# Altium project OpenRing-V1R1.PrjPcb (part 2 of 2)

## Sheet OpenRing_Memory.SchDoc
size A4; Size: A4; ApprovedBy: Dariush Salami; DrawnBy: Yusein Ali; Engineer: Yusein Ali; Revision: A0; SheetNumber: 3; SheetTotal: 9
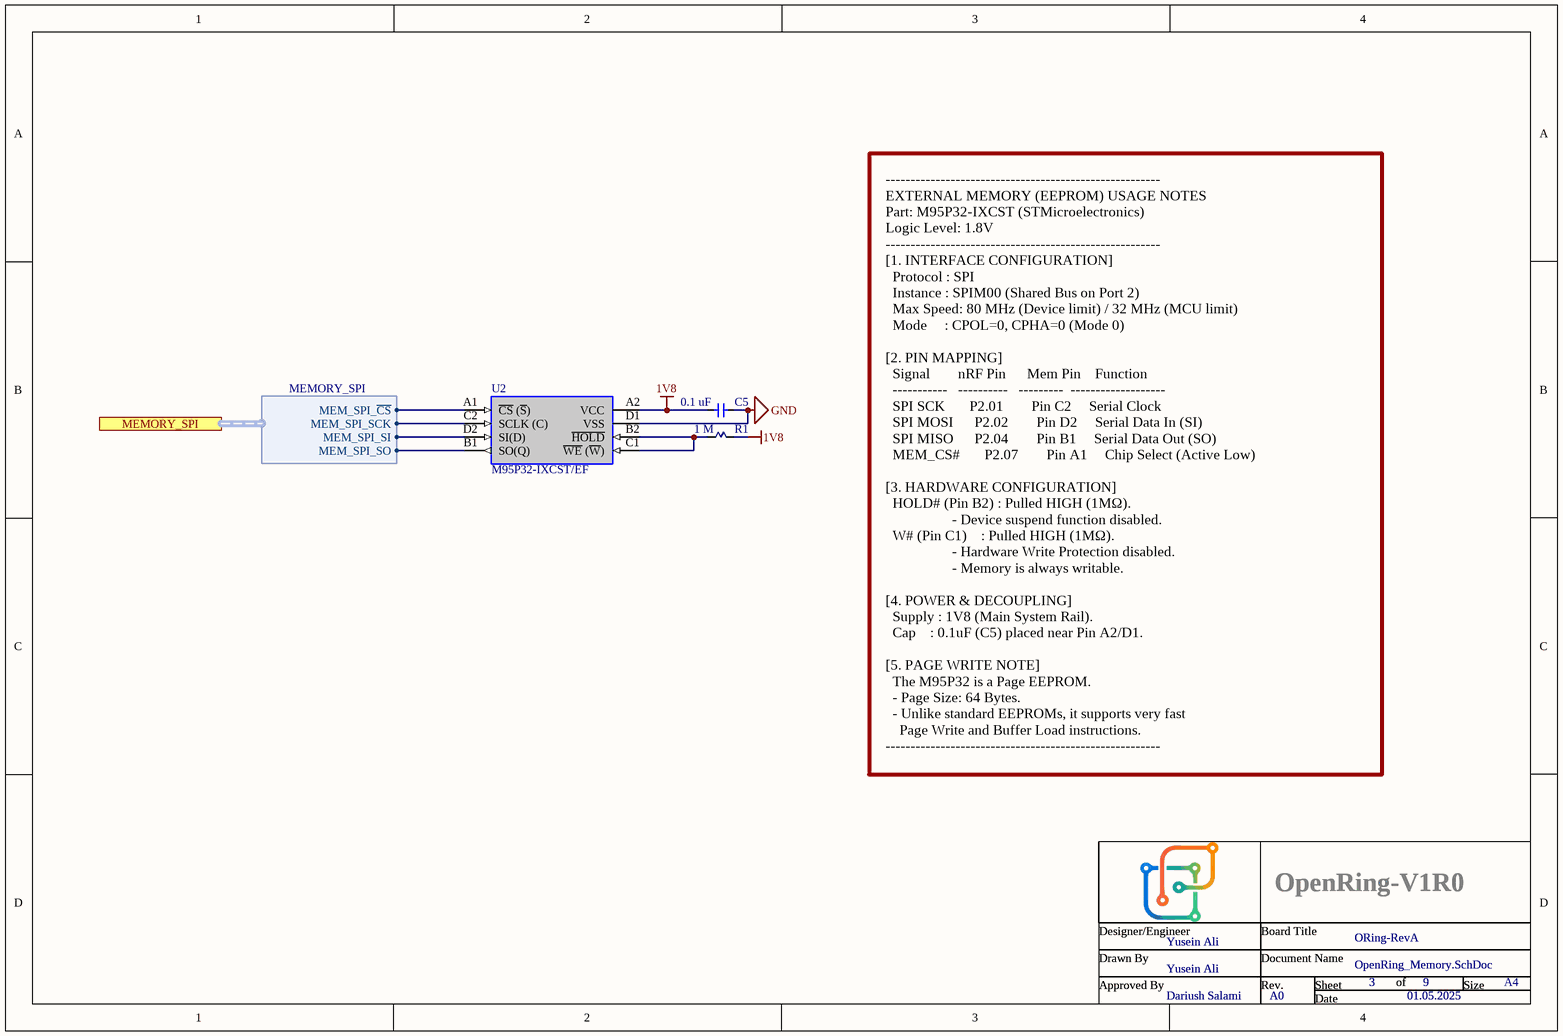
[diagram p4: OpenRing_Memory.SchDoc]

### Parts
C5  0.1 uF  [CAPC1005X05N]
R1  1 M  [RESC1005X04N]
U2  M95P32-IXCST/EF  [BGA8C70P2X4_153X261X58]

### Ports
MEMORY_SPI (harness MEMORY_SPI)

### Harnesses
MEMORY_SPI: MEM_SPI_~{CS}, MEM_SPI_SI, MEM_SPI_SO, MEM_SPI_SCK

### Nets
1V8: C5.2 R1.2 U2.A2(VCC)
GND: C5.1 U2.D1(VSS)
MEM_SPI_~{CS}: U2.A1(~{CS}_(~{S})) ; port MEMORY_SPI.MEM_SPI_~{CS}
MPU_CLK: U2.C2(SCLK_(C)) ; port MEMORY_SPI.MEM_SPI_SCK
MPU_MISO: U2.B1(SO(Q)) ; port MEMORY_SPI.MEM_SPI_SO
MPU_MOSI: U2.D2(SI(D)) ; port MEMORY_SPI.MEM_SPI_SI
NetR1_1: R1.1 U2.B2(~{HOLD}) U2.C1(~{WE}_(~{W}))

### Notes on the sheet
- -------------------------------------------------------
  EXTERNAL MEMORY (EEPROM) USAGE NOTES
  Part: M95P32-IXCST (STMicroelectronics)
  Logic Level: 1.8V
  -------------------------------------------------------
  [1. INTERFACE CONFIGURATION]
  Protocol : SPI
  Instance : SPIM00 (Shared Bus on Port 2)
  Max Speed: 80 MHz (Device limit) / 32 MHz (MCU limit)
  Mode     : CPOL=0, CPHA=0 (Mode 0)
  [2. PIN MAPPING]
  Signal        nRF Pin      Mem Pin    Function
  -----------   ----------   ---------  -------------------
  SPI SCK       P2.01        Pin C2     Serial Clock
  SPI MOSI      P2.02        Pin D2     Serial Data In (SI)
  SPI MISO      P2.04        Pin B1     Serial Data Out (SO)
  MEM_CS#       P2.07        Pin A1     Chip Select (Active Low)
  [3. HARDWARE CONFIGURATION]
  HOLD# (Pin B2) : Pulled HIGH (1MΩ).
  - Device suspend function disabled.
  W# (Pin C1)    : Pulled HIGH (1MΩ).
  - Hardware Write Protection disabled.
  - Memory is always writable.
  [4. POWER & DECOUPLING]
  Supply : 1V8 (Main System Rail).
  Cap    : 0.1uF (C5) placed near Pin A2/D1.
  [5. PAGE WRITE NOTE]
  The M95P32 is a Page EEPROM.
  - Page Size: 64 Bytes.
  - Unlike standard EEPROMs, it supports very fast
  Page Write and Buffer Load instructions.
  -------------------------------------------------------
- Designer/Engineer
- Drawn By
- Document Name
- Board Title
- Sheet
- of
- Size
- A4
- Approved By
- Rev.
- Date

### Library data of the parts
C5 = GRM155R61C104KA88D: CAP CER 0.1UF 16V X5R 0402; Manufacturer: Murata Electronics; Tolerance: 10 %; Type: Chip Multilayer Ceramic Capacitor for General Purpose; Voltage Rating DC: 16 VDC; Capacitance - nF: 100 nF; Capacitance - pF: 100000 pF; Supplier 1: Mouser; Manufacturer Part Number: GRM155R61C104KA88D; RoHS: RoHS Compliant; Category: Multilayer Ceramic Capacitors MLCC - SMD/SMT; Packaging: Cut Tape; Capacitance: 0.1 uF; Package / Case: 0402 (1005 metric); ComponentLink1URL: http://www.mouser.com/datasheet/2/281/murata_03052018_GRM_Series_1-1310166.pdf; ComponentLink1Description: http://www.mouser.com/datasheet/2/281/murata_03052018_GRM_Series_1-1310166.pdf; Supplier Part Number 1: 81-GRM155R61C104KA8D; Value: 0.1 uF; Stock: 0; Pricing: 1=0.082, 10=0.026, 100=0.011, 500=0.008, 1000=0.007, 2500=0.006, 5000=0.005, 10000=0.004 (EUR); Height: 0.5 mm; Length: 1 mm; Product: General Type MLCCs; Series: GRM; Termination Style: SMD/SMT; Width: 0.5 mm; Brand: Murata Electronics; Case Code - in: 0402; Case Code - mm: 1005; Dielectric: X5R; Maximum Operating Temperature: + 85 C; Minimum Operating Temperature: - 55 C; Standard Pack Qty: 10000; Termination: Standard; RoHS - Mouser: Y; Minimum Order Quantity: 1; Reeling: True; Supplier 2: Digikey; Supplier Part Number 2: 490-5415-1-ND; Supplier 3: Digikey; Supplier Part Number 3: 490-5415-6-ND
R1 = ERJ-2RKF1004X: RES SMD 1M OHM 1% 1/10W 0402; Manufacturer: Panasonic Electronic Components; Power (Watts): 0.1W, 1/10W; Temperature Coefficient: ±100ppm/°C; Supplier 1: Digi-Key; Manufacturer Part Number: ERJ-2RKF1004X; RoHS: RoHS Compliant; Category: Resistors; Stock 1: 1590446; Pricing 1: 1=0.1, 10=0.025, 25=0.018, 50=0.0136, 100=0.01, 250=0.00764, 500=0.00612, 1000=0.00451, 5000=0.00323 (USD); Packaging: Digi-Reel®; Part Status: Active; Resistance (Ohms): 1M; Tolerance: ±1%; Composition: Thick Film; Features: Automotive AEC-Q200; Operating Temperature: -55°C ~ 155°C; Package / Case: 0402 (1005 Metric); Supplier Device Package: 0402; Size / Dimension: 0.039" L x 0.020" W (1.00mm x 0.50mm); Height - Seated (Max): 0.016" (0.40mm); Number of Terminations: 2; Failure Rate: -; ComponentLink1URL: https://industrial.panasonic.com/cdbs/www-data/pdf/RDA0000/AOA0000C283.pdf; ComponentLink1Description: https://industrial.panasonic.com/cdbs/www-data/pdf/RDA0000/AOA0000C283.pdf; Supplier Part Number 1: P1.00MLDKR-ND; Value: 1 M
U2 = M95P32-IXCST/EF: M95P32-I Series 32 Mb (4 M x 8) 80 MHz SPI EEPROM Memory IC - WLCSP-8; Manufacturer: STMicroelectronics; Supplier: Digikey; Supplier Part Number: 497-M95P32-IXCST/EFDKR-ND; Manufacturer Part Number: M95P32-IXCST/EF; RoHS: No; Category: Memory; Stock: 9222; Pricing: 1=2.68, 10=2.409, 25=2.2724, 100=1.9362, 250=1.818, 500=1.59076, 1000=1.31805, 2500=1.22715 (USD); Supplier 1: Mouser; Supplier Part Number 1: 511-M95P32-IXCST/EF; Supplier 2: Digikey; Supplier Part Number 2: 497-M95P32-IXCST/EFCT-ND

## Sheet OpenRing_RGB.SchDoc
size A4; Size: A4; ApprovedBy: Dariush Salami; DrawnBy: Yusein Ali; Engineer: Yusein Ali; Revision: A0; SheetNumber: 6; SheetTotal: 9
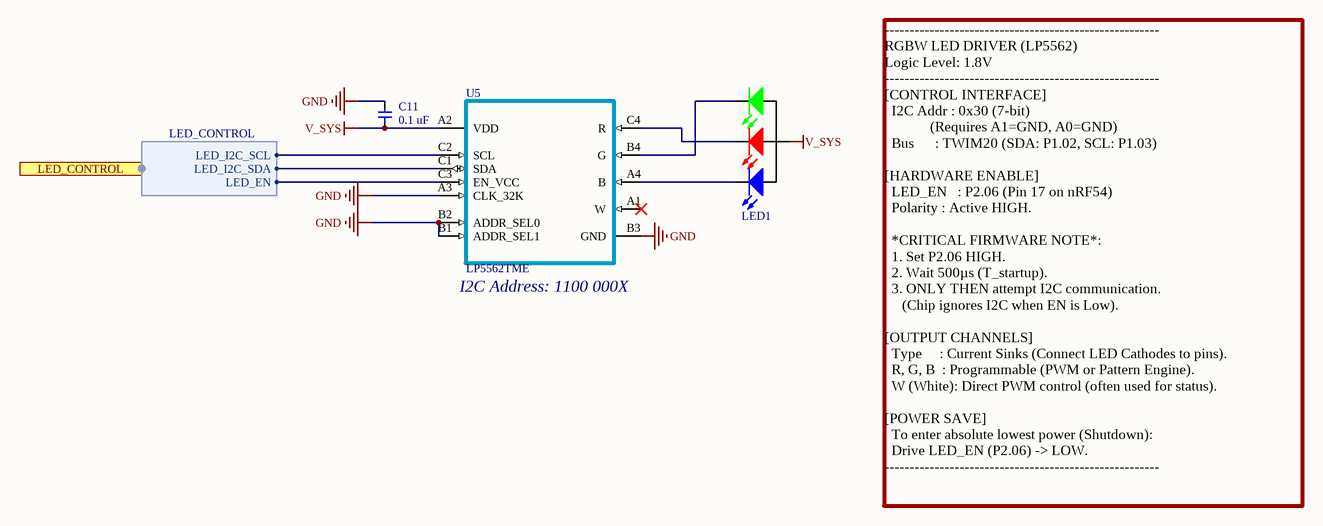
[diagram p5: OpenRing_RGB.SchDoc]

### Parts
C11  0.1 uF  [CAPC1005X05N]
LED1  SML-LX0404SIUPGUSB  [SML-LX0404SIUPGUSB]  (value not drawn)
U5  LP5562TME  [BGA12C40P4X3_162X122X68]

### Ports
LED_CONTROL (harness LED_CONTROL)

### Harnesses
LED_CONTROL: LED_I2C_SCL, LED_I2C_SDA, LED_EN

### Nets
GND: C11.2 U5.A3(CLK_32K) U5.B1(ADDR_SEL1) U5.B2(ADDR_SEL0) U5.B3(GND)
V_SYS: C11.1 LED1.1(A) U5.A2(VDD)
LED_EN: U5.C3(EN_VCC) ; port LED_CONTROL.LED_EN
PWR_I2C_SCL: U5.C2(SCL) ; port LED_CONTROL.LED_I2C_SCL
PWR_I2C_SDA: U5.C1(SDA) ; port LED_CONTROL.LED_I2C_SDA
NetLED1_2: LED1.2(K) U5.C4(R)
NetLED1_3: LED1.3(K) U5.A4(B)
NetLED1_4: LED1.4(K) U5.B4(G)

Not connected (* = marked no-connect by the designer): U5 A1(W)*

### Notes on the sheet
- (near U5) I2C Address: 1100 000X
- -------------------------------------------------------
  RGBW LED DRIVER (LP5562)
  Logic Level: 1.8V
  -------------------------------------------------------
  [CONTROL INTERFACE]
  I2C Addr : 0x30 (7-bit)
  (Requires A1=GND, A0=GND)
  Bus      : TWIM20 (SDA: P1.02, SCL: P1.03)
  [HARDWARE ENABLE]
  LED_EN   : P2.06 (Pin 17 on nRF54)
  Polarity : Active HIGH.
  *CRITICAL FIRMWARE NOTE*:
  1. Set P2.06 HIGH.
  2. Wait 500µs (T_startup).
  3. ONLY THEN attempt I2C communication.
  (Chip ignores I2C when EN is Low).
  [OUTPUT CHANNELS]
  Type     : Current Sinks (Connect LED Cathodes to pins).
  R, G, B  : Programmable (PWM or Pattern Engine).
  W (White): Direct PWM control (often used for status).
  [POWER SAVE]
  To enter absolute lowest power (Shutdown):
  Drive LED_EN (P2.06) -> LOW.
  -------------------------------------------------------
- Designer/Engineer
- Drawn By
- Document Name
- Board Title
- Sheet
- of
- Size
- A4
- Approved By
- Rev.
- Date

### Library data of the parts
C11 = GRM155R61C104KA88D: as C5 on sheet OpenRing_Memory; Supplier 1: Mouser; Manufacturer Part Number: GRM155R61C104KA88D; RoHS: RoHS Compliant; Category: Multilayer Ceramic Capacitors MLCC - SMD/SMT; Packaging: Cut Tape; Capacitance: 0.1 uF; Package / Case: 0402 (1005 metric); ComponentLink1URL: http://www.mouser.com/datasheet/2/281/murata_03052018_GRM_Series_1-1310166.pdf; ComponentLink1Description: http://www.mouser.com/datasheet/2/281/murata_03052018_GRM_Series_1-1310166.pdf; Supplier Part Number 1: 81-GRM155R61C104KA8D; Value: 0.1 uF; Stock: 0; Pricing: 1=0.082, 10=0.026, 100=0.011, 500=0.008, 1000=0.007, 2500=0.006, 5000=0.005, 10000=0.004 (EUR); Height: 0.5 mm; Length: 1 mm; Product: General Type MLCCs; Series: GRM; Termination Style: SMD/SMT; Width: 0.5 mm; Brand: Murata Electronics; Case Code - in: 0402; Case Code - mm: 1005; Dielectric: X5R; Maximum Operating Temperature: + 85 C; Minimum Operating Temperature: - 55 C; Standard Pack Qty: 10000; Termination: Standard; RoHS - Mouser: Y; Minimum Order Quantity: 1; Reeling: True; Supplier 2: Digikey; Supplier Part Number 2: 490-5415-1-ND; Supplier 3: Digikey; Supplier Part Number 3: 490-5415-6-ND
LED1 = SML-LX0404SIUPGUSB: LED Low-Power Tri-Color Blue/Green/Red 465nm/518nm/632nm 2.7V/2.75V/1.95V 4-Pin SMD T/R; Manufacturer: Lumex; Color: Blue,Green,Red; Lens Color: Colorless; Lens Transparency: Clear; Viewing Angle: 120°; Lens Style: Square,Clear,Rectangular; Forward Current: 2mA; Luminous Intensity: 20mcd; Forward Voltage: 2.73V; Number of LEDs: 3; Wavelength: 465nm; Power Rating: 30mW; Reverse Voltage: 5V; Manufacturer Part Number: SML-LX0404SIUPGUSB; RoHS: Yes; Category: LEDs; Packaging: Tape and Reel; ComponentLink1URL: https://datasheet.ciiva.com/1246/1423960-1246392.pdf?src-supplier=Element14; ComponentLink1Description: https://datasheet.ciiva.com/1246/1423960-1246392.pdf?src-supplier=Element14; Supplier: Mouser; Supplier Part Number: 696-LX0404SIUPGUSB; Stock: 113976; Pricing: 1=0.94, 10=0.633, 50=0.633, 100=0.518, 1000=0.444, 10000=0.371 (USD); Mounting Technology: Surface Mount; Case/Package: 0404; Case Code (Metric): 1010; Case Code (Imperial): 0404; Min Operating Temperature: -40°C; Max Operating Temperature: 85°C; Package Quantity: 2000; Test Current: 2mA; Series: -; Moisture Sensitivity Level: 4; Length: 1mm; Width: 1mm; Height: 0.3mm; Reach SVHC Compliant: No; Lead Free: Lead Free; RoHS Compliant: Yes; ComponentLink2URL: https://datasheet.ciiva.com/1333/lumex-quasarbrite-0404smdrgb-productbrochure-1333009.pdf?src-supplier=Newark; ComponentLink2Description: https://datasheet.ciiva.com/1333/lumex-quasarbrite-0404smdrgb-productbrochure-1333009.pdf?src-supplier=Newark; ComponentLink3URL: https://datasheet.ciiva.com/2118/sml-lx0404siupgusb-2118652.pdf?src-supplier=Digikey; ComponentLink3Description: https://datasheet.ciiva.com/2118/sml-lx0404siupgusb-2118652.pdf?src-supplier=Digikey; ComponentLink4URL: https://datasheet.ciiva.com/4689/sml-lx0404siupgusb-202559-4689572.pdf?src-supplier=Mouser; ComponentLink4Description: https://datasheet.ciiva.com/4689/sml-lx0404siupgusb-202559-4689572.pdf?src-supplier=Mouser; ComponentLink5URL: https://datasheet.ciiva.com/16199/sml-lx0404siupgusb-16199820.pdf?src-supplier=Future+Electronics; ComponentLink5Description: https://datasheet.ciiva.com/16199/sml-lx0404siupgusb-16199820.pdf?src-supplier=Future+Electronics; ComponentLink6URL: https://datasheet.ciiva.com/1246/1484526-1246779.pdf?src-supplier=Element14; ComponentLink6Description: https://datasheet.ciiva.com/1246/1484526-1246779.pdf?src-supplier=Element14; ComponentLink7URL: https://datasheet.ciiva.com/2118/sml-lx0404siupgusb-2118653.pdf?src-supplier=Digikey; ComponentLink7Description: https://datasheet.ciiva.com/2118/sml-lx0404siupgusb-2118653.pdf?src-supplier=Digikey; ComponentLink8URL: https://datasheet.ciiva.com/2118/sml-lx0404siupgusb-2118654.pdf?src-supplier=Digikey; ComponentLink8Description: https://datasheet.ciiva.com/2118/sml-lx0404siupgusb-2118654.pdf?src-supplier=Digikey; ComponentLink9URL: https://datasheet.ciiva.com/14604/70127422-14604949.pdf?src-supplier=Allied+Electronics; ComponentLink9Description: https://datasheet.ciiva.com/14604/70127422-14604949.pdf?src-supplier=Allied+Electronics
U5 = LP5562TME/NOPB: IC LED DRIVER LINEAR DIM 25.5MA; Manufacturer: Texas Instruments; Internal Switch(s): Yes; Number of Outputs: 4; Voltage - Supply (Min): 2.7V; Voltage - Supply (Max): 5.5V; Frequency: 256kHz, 558kHz; Dimming: I²C; Supplier 1: Digi-Key; Manufacturer Part Number: LP5562TME/NOPB; RoHS: RoHS Compliant; Category: Integrated Circuits (ICs); Stock 1: 4154; Pricing 1: 1=1.34, 10=1.195, 100=0.9314 (USD); Packaging: Digi-Reel®; Part Status: Active; Type: Linear; Topology: -; Voltage - Output: -; Current - Output / Channel: 25.5mA; Applications: Backlight; Operating Temperature: -40°C ~ 85°C (TA); Mounting Type: Surface Mount; Package / Case: 12-WFBGA, DSBGA; Supplier Device Package: 12-DSBGA; ComponentLink1URL: http://www.ti.com/lit/ds/symlink/lp5562.pdf; ComponentLink1Description: http://www.ti.com/lit/ds/symlink/lp5562.pdf; Supplier Part Number 1: 296-39060-6-ND

## Sheet OpenRing_DaughterBoard.SchDoc
size A4; SheetNumber: 9; SheetTotal: 9
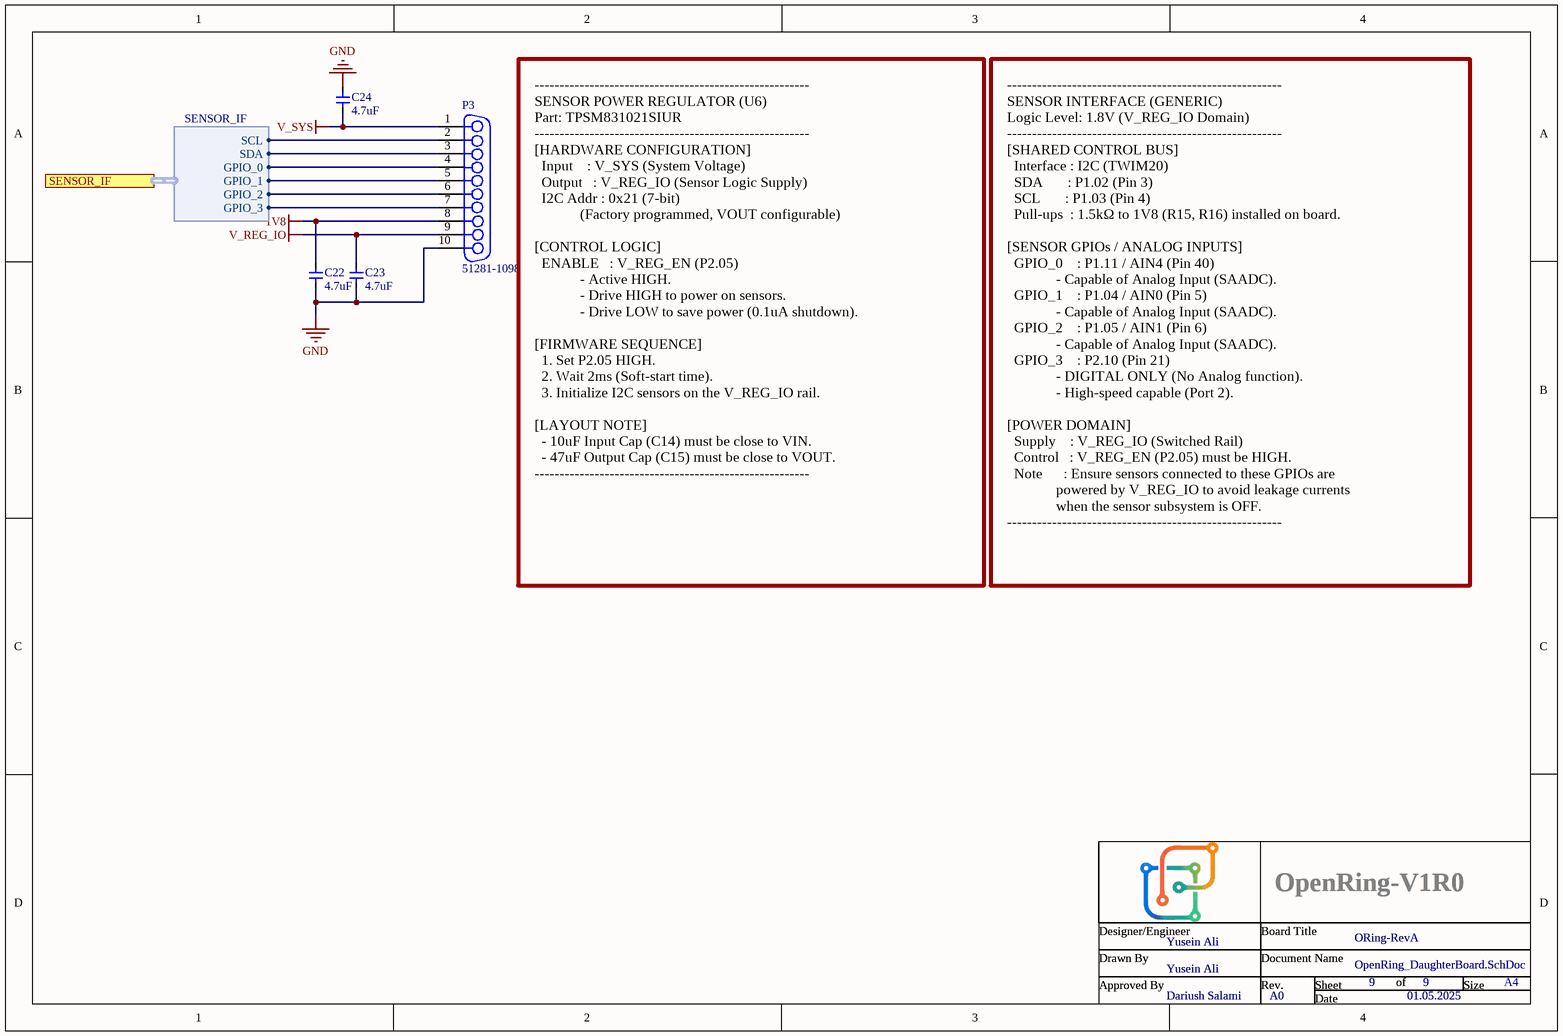
[diagram p6: OpenRing_DaughterBoard.SchDoc]

### Parts
C22  4.7uF  [CAPC1005X05N]
C23  4.7uF  [CAPC1005X05N]
C24  4.7uF  [CAPC1005X05N]
P3  51281-1098  [51281-1098]

### Ports
SENSOR_IF (harness SENSOR_IF)

### Harnesses
SENSOR_IF: SCL, SDA, GPIO_0, GPIO_1, GPIO_2, GPIO_3

### Nets
1V8: C22.2 P3.8
GND: C22.1 C23.1 C24.2 P3.10
V_REG_IO: C23.2 P3.9
V_SYS: C24.1 P3.1
PWR_I2C_SCL: P3.2 ; port SENSOR_IF.SCL
PWR_I2C_SDA: P3.3 ; port SENSOR_IF.SDA
SENSOR_GPIO_0: P3.4 ; port SENSOR_IF.GPIO_0
SENSOR_GPIO_1: P3.5 ; port SENSOR_IF.GPIO_1
SENSOR_GPIO_2: P3.6 ; port SENSOR_IF.GPIO_2
SENSOR_GPIO_3: P3.7 ; port SENSOR_IF.GPIO_3

### Notes on the sheet
- -------------------------------------------------------
  SENSOR POWER REGULATOR (U6)
  Part: TPSM831021SIUR
  -------------------------------------------------------
  [HARDWARE CONFIGURATION]
  Input    : V_SYS (System Voltage)
  Output   : V_REG_IO (Sensor Logic Supply)
  I2C Addr : 0x21 (7-bit)
  (Factory programmed, VOUT configurable)
  [CONTROL LOGIC]
  ENABLE   : V_REG_EN (P2.05)
  - Active HIGH.
  - Drive HIGH to power on sensors.
  - Drive LOW to save power (0.1uA shutdown).
  [FIRMWARE SEQUENCE]
  1. Set P2.05 HIGH.
  2. Wait 2ms (Soft-start time).
  3. Initialize I2C sensors on the V_REG_IO rail.
  [LAYOUT NOTE]
  - 10uF Input Cap (C14) must be close to VIN.
  - 47uF Output Cap (C15) must be close to VOUT.
  -------------------------------------------------------
- -------------------------------------------------------
  SENSOR INTERFACE (GENERIC)
  Logic Level: 1.8V (V_REG_IO Domain)
  -------------------------------------------------------
  [SHARED CONTROL BUS]
  Interface : I2C (TWIM20)
  SDA       : P1.02 (Pin 3)
  SCL       : P1.03 (Pin 4)
  Pull-ups  : 1.5kΩ to 1V8 (R15, R16) installed on board.
  [SENSOR GPIOs / ANALOG INPUTS]
  GPIO_0    : P1.11 / AIN4 (Pin 40)
  - Capable of Analog Input (SAADC).
  GPIO_1    : P1.04 / AIN0 (Pin 5)
  - Capable of Analog Input (SAADC).
  GPIO_2    : P1.05 / AIN1 (Pin 6)
  - Capable of Analog Input (SAADC).
  GPIO_3    : P2.10 (Pin 21)
  - DIGITAL ONLY (No Analog function).
  - High-speed capable (Port 2).
  [POWER DOMAIN]
  Supply    : V_REG_IO (Switched Rail)
  Control   : V_REG_EN (P2.05) must be HIGH.
  Note      : Ensure sensors connected to these GPIOs are
  powered by V_REG_IO to avoid leakage currents
  when the sensor subsystem is OFF.
  -------------------------------------------------------
- Designer/Engineer
- Drawn By
- Document Name
- Board Title
- Sheet
- of
- Size
- A4
- Approved By
- Rev.
- Date

### Library data of the parts
C22-C24 = GRM155R61A475MEAAD: Multilayer Ceramic Capacitor, 4.7 uF, 10 V, ± 20%, X5R, 0402 [1005 Metric]; Manufacturer: Murata; Material: 4241ConductorMaterial; Voltage Rating: 10V; Dielectric: 1537DielectricType; Manufacturer Part Number: GRM155R61A475MEAAD; RoHS: Yes; Category: Ceramic Capacitors; Stock: 930000; Pricing: 10000=0,0187, 50000=0,0159, 100000=0,0132 (USD); Mounting Technology: Surface Mount; Case/Package: 0402; Case Code (Imperial): 0402; Case Code (Metric): 1005; Min Operating Temperature: -55°C; Max Operating Temperature: 85°C; Packaging: Tape and Reel; Value: 4.7uF; Tolerance: 20%; Series: GRM; Voltage Rating (DC): 10V; Length: 1mm; Width: 500um; Height: 650um; Thickness: 500um; RoHS Compliant: Yes; ComponentLink1URL: http://www.farnell.com/datasheets/2189109.pdf?src-supplier=Farnell; ComponentLink1Description: http://www.farnell.com/datasheets/2189109.pdf?src-supplier=Farnell; ComponentLink2URL: http://www.farnell.com/datasheets/2189109.pdf?src-supplier=Newark; ComponentLink2Description: http://www.farnell.com/datasheets/2189109.pdf?src-supplier=Newark; ComponentLink3URL: http://www.farnell.com/datasheets/2189109.pdf?src-supplier=Element14; ComponentLink3Description: http://www.farnell.com/datasheets/2189109.pdf?src-supplier=Element14; ComponentLink4URL: http://datasheet.octopart.com/GRM155R61A475MEAAD-Murata-datasheet-68589269.pdf?src-supplier=Distrelec; ComponentLink4Description: http://datasheet.octopart.com/GRM155R61A475MEAAD-Murata-datasheet-68589269.pdf?src-supplier=Distrelec; ComponentLink5URL: http://datasheet.octopart.com/GRM155R61A475MEAAD-Murata-datasheet-68589269.pdf?src-supplier=Farnell; ComponentLink5Description: http://datasheet.octopart.com/GRM155R61A475MEAAD-Murata-datasheet-68589269.pdf?src-supplier=Farnell; ComponentLink6URL: https://search.murata.co.jp/Ceramy/image/img/A01X/G101/ENG/GRM155R61A475MEAA-01.pdf?src-supplier=Digi-Key; ComponentLink6Description: https://search.murata.co.jp/Ceramy/image/img/A01X/G101/ENG/GRM155R61A475MEAA-01.pdf?src-supplier=Digi-Key; ComponentLink7URL: http://datasheet.octopart.com/GRM155R61A475MEAAD-Murata-datasheet-68589269.pdf?src-supplier=Future+Electronics; ComponentLink7Description: http://datasheet.octopart.com/GRM155R61A475MEAAD-Murata-datasheet-68589269.pdf?src-supplier=Future+Electronics; ComponentLink8URL: https://datasheet.octopart.com/GRM155R61A475MEAAD-Murata-datasheet-68589269.pdf?src-supplier=Newark; ComponentLink8Description: https://datasheet.octopart.com/GRM155R61A475MEAAD-Murata-datasheet-68589269.pdf?src-supplier=Newark; ComponentLink9URL: http://datasheet.octopart.com/GRM155R61A475MEAAD-Murata-datasheet-68589269.pdf?src-supplier=Verical; ComponentLink9Description: http://datasheet.octopart.com/GRM155R61A475MEAAD-Murata-datasheet-68589269.pdf?src-supplier=Verical; ComponentLink10URL: https://datasheet.octopart.com/GRM155R61A475MEAAD-Murata-datasheet-165579666.pdf?src-supplier=TME; ComponentLink10Description: https://datasheet.octopart.com/GRM155R61A475MEAAD-Murata-datasheet-165579666.pdf?src-supplier=TME; ComponentLink11URL: http://datasheet.octopart.com/GRM155R61A475MEAAD-Murata-datasheet-68589269.pdf?src-supplier=Quest; ComponentLink11Description: http://datasheet.octopart.com/GRM155R61A475MEAAD-Murata-datasheet-68589269.pdf?src-supplier=Quest; ComponentLink12URL: http://datasheet.octopart.com/GRM155R61A475MEAAD-Murata-datasheet-68589269.pdf?src-supplier=TTI; ComponentLink12Description: http://datasheet.octopart.com/GRM155R61A475MEAAD-Murata-datasheet-68589269.pdf?src-supplier=TTI; ComponentLink13URL: http://datasheet.octopart.com/GRM155R61A475MEAAD-Murata-datasheet-68589269.pdf?src-supplier=NAC+Semi; ComponentLink13Description: http://datasheet.octopart.com/GRM155R61A475MEAAD-Murata-datasheet-68589269.pdf?src-supplier=NAC+Semi; Supplier 1: Mouser; Supplier Part Number 1: 81-GRM155R61A475MEAD; Supplier 2: Farnell; Supplier Part Number 2: 3581674
P3 = 51281-1098: FFC/FPC Connector, Surface Mount, Right-Angle, Non-ZIF, Dual Contact Style; Manufacturer: Molex; Supplier: Digikey; Supplier Part Number: 900-0512811098CT-ND; Manufacturer Part Number: 51281-1098; RoHS: No; Stock: 2876; Pricing: 1=0.7, 10=0.594, 25=0.5568, 50=0.53, 100=0.5047, 250=0.47304, 500=0.45042, 1000=0.42891 (USD); ComponentLink1URL: https://datasheet.octopart.com/51281-1098-Molex-datasheet-165827616.pdf?src-supplier=Farnell; ComponentLink1Description: https://datasheet.octopart.com/51281-1098-Molex-datasheet-165827616.pdf?src-supplier=Farnell; Supplier 1: Mouser; Supplier Part Number 1: 538-51281-1098; Supplier 2: Digikey; Supplier Part Number 2: 900-0512811098CT-ND; Supplier 3: Digikey; Supplier Part Number 3: 900-0512811098DKR-ND; System: Connector

## Sheet OpenRing_Power.SchDoc
size A4; Size: A4; ApprovedBy: Dariush Salami; DrawnBy: Yusein Ali; Engineer: Yusein Ali; Revision: A0; SheetNumber: 4; SheetTotal: 9
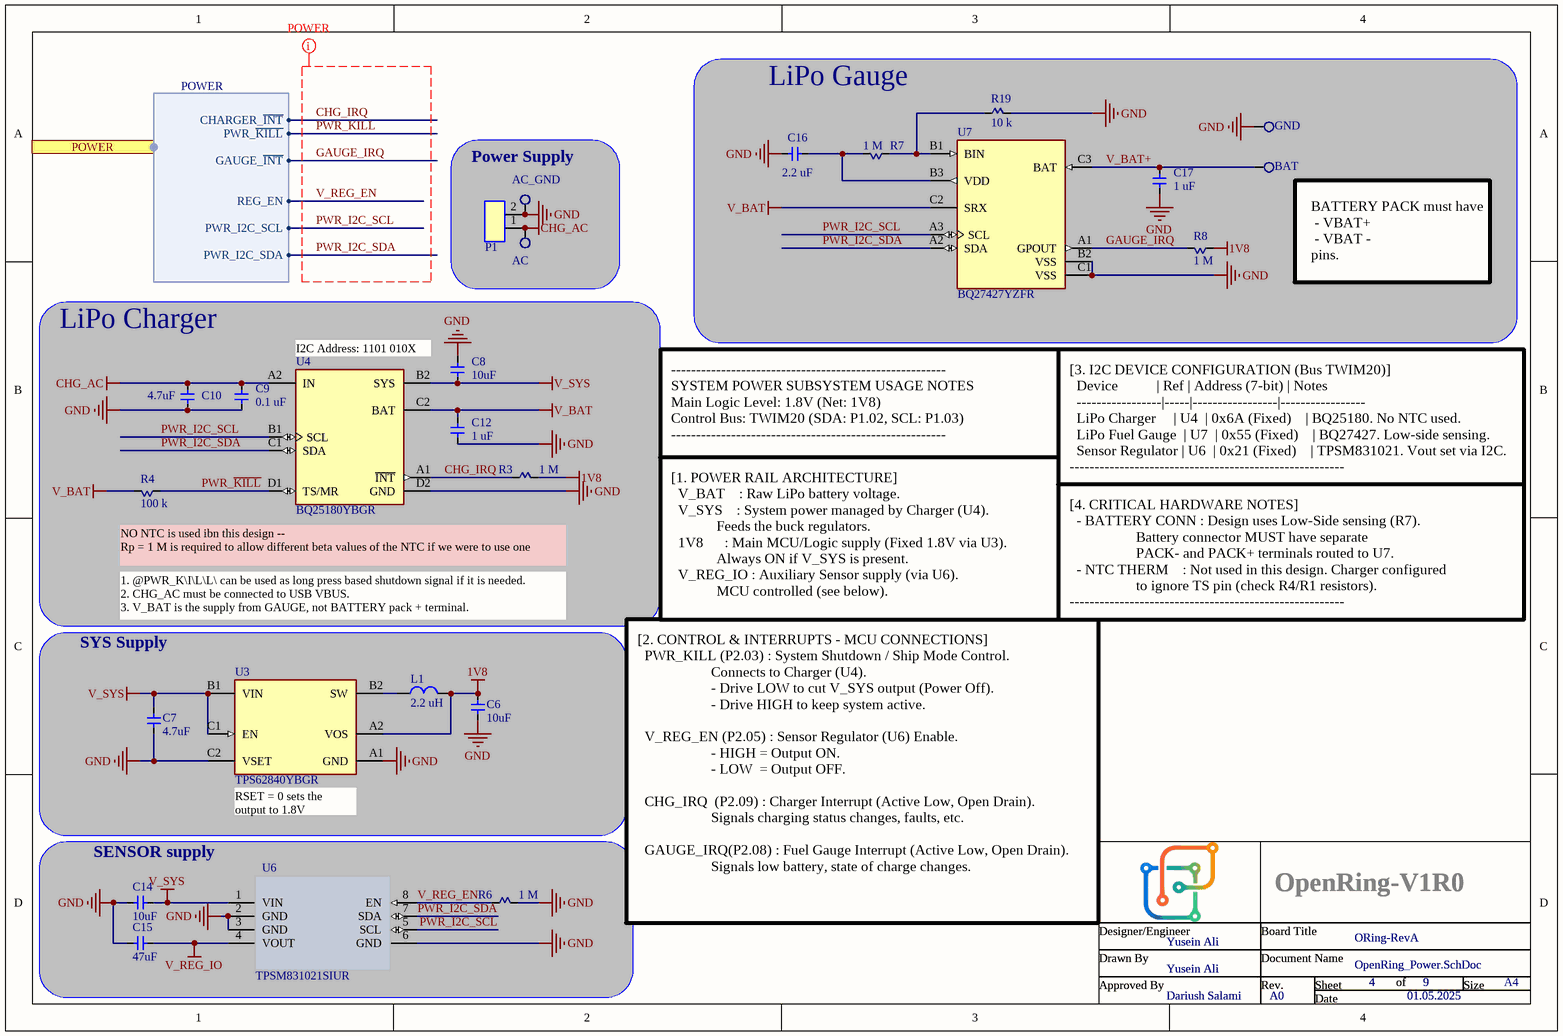
[diagram p7: OpenRing_Power.SchDoc]

### Parts
AC  TESTPAD  [TEST_PAD]  (value not drawn)  (no BOM)
AC_GND  TESTPAD  [TEST_PAD]  (value not drawn)  (no BOM)
BAT  TESTPAD  [TEST_PAD]  (value not drawn)  (no BOM)
C6  10uF  [CAPC1005X05N]
C7  4.7uF  [CAPC1005X05N]
C8  10uF  [CAPC1005X05N]
C9  0.1 uF  [CAPC1005X05N]
C10  4.7uF  [CAPC1005X05N]
C12  1 uF  [CAPC1005X05N]
C14  10uF  [CAPC1005X05N]
C15  47uF  [CAPC1610X05N]
C16  2.2 uF  [CAPC1005X05N]
C17  1 uF  [CAPC1005X05N]
GND  TESTPAD  [TEST_PAD]  (value not drawn)  (no BOM)
L1  2.2 uH  [FP-DFE201612C-MFG]
P1  RM-1238-B02-41  [RM-1238-B02-41_2]  (value not drawn)
R3  1 M  [RESC1005X04N]
R4  100 k  [RESC1005X04N]
R6  1 M  [RESC1005X04N]
R7  1 M  [RESC1005X04N]
R8  1 M  [RESC1005X04N]
R19  10 k  [RESC1005X04N]
U3  TPS62840YBGR  [BGA6C40P2X3_97X147X50]
U4  BQ25180YBGR  [BGA8C40P2X4_104X159X50]
U6  TPSM831021SIUR  [MicroSiP8_SIU-A_TEX-M]
U7  BQ27427YZFR  [BGA9C50P3X3_158X162X62]

### Blocks framed on the sheet
LiPo Gauge: BAT C16 C17 GND R7 R8 R19 U7
Power Supply: AC AC_GND P1
LiPo Charger: C8-C10 C12 R3 R4 U4
SYS Supply: C6 C7 L1 U3
SENSOR supply: C14 C15 R6 U6

### Ports
POWER (harness POWER)

### Harnesses
POWER: CHARGER_~{INT}, PWR_I2C_SCL, PWR_~{KILL}, GAUGE_~{INT}, PWR_I2C_SDA, REG_EN

### Nets
1V8: C6.1 L1.2 R3.1 R8.1 U3.A2(VOS)
CHG_AC: AC.1 C9.1 C10.2 P1.1 U4.A2(IN)
GND: AC_GND.1 C6.2 C7.1 C8.2 C9.2 C10.1 C12.2 C14.1 C15.1 C16.2 C17.2 GND.1 P1.2 R6.1 R19.2 U3.A1(GND) U3.C2(VSET) U4.D2(GND) U6.2(GND) U6.3(GND) U6.6(GND) U7.B2(VSS) U7.C1(VSS)
V_BAT: C12.1 R4.2 U4.C2(BAT) U7.C2(SRX)
V_REG_IO: C15.2 U6.4(VOUT)
V_SYS: C7.2 C8.1 C14.2 U3.B1(VIN) U3.C1(EN) U4.B2(SYS) U6.1(VIN)
CHG_IRQ: R3.2 U4.A1(~{INT}) ; port POWER.CHARGER_~{INT}
GAUGE_IRQ: R8.2 U7.A1(GPOUT) ; port POWER.GAUGE_~{INT}
PWR_I2C_SCL: U4.B1(SCL) U6.5(SCL) U7.A3(SCL) ; port POWER.PWR_I2C_SCL
PWR_I2C_SDA: U4.C1(SDA) U6.7(SDA) U7.A2(SDA) ; port POWER.PWR_I2C_SDA
PWR_~{KILL}: R4.1 U4.D1(TS/MR) ; port POWER.PWR_~{KILL}
V_BAT+: BAT.1 C17.1 U7.C3(BAT)
V_REG_EN: R6.2 U6.8(EN) ; port POWER.REG_EN
NetC16_1: C16.1 R7.2 U7.B3(VDD)
NetL1_1: L1.1 U3.B2(SW)
NetR7_1: R7.1 R19.1 U7.B1(BIN)

### Layout directives
net class PWR Control: CHG_IRQ, GAUGE_IRQ, PWR_I2C_SCL, PWR_I2C_SDA, PWR_~{KILL}, V_REG_EN

### Notes on the sheet
- (near BAT) BATTERY PACK must have
  - VBAT+
  - VBAT -
  pins.
- I2C Address: 1101 010X
- -------------------------------------------------------
  SYSTEM POWER SUBSYSTEM USAGE NOTES
  Main Logic Level: 1.8V (Net: 1V8)
  Control Bus: TWIM20 (SDA: P1.02, SCL: P1.03)
  -------------------------------------------------------
- [3. I2C DEVICE CONFIGURATION (Bus TWIM20)]
  Device           | Ref | Address (7-bit) | Notes
  -----------------|-----|-----------------|-----------------
  LiPo Charger     | U4  | 0x6A (Fixed)    | BQ25180. No NTC used.
  LiPo Fuel Gauge  | U7  | 0x55 (Fixed)    | BQ27427. Low-side sensing.
  Sensor Regulator | U6  | 0x21 (Fixed)    | TPSM831021. Vout set via I2C.
  -------------------------------------------------------
- NO NTC is used ibn this design --
  Rp = 1 M is required to allow different beta values of the NTC if we were to use one
- 1. @PWR_K\I\L\L\ can be used as long press based shutdown signal if it is needed.
  2. CHG_AC must be connected to USB VBUS.
  3. V_BAT is the supply from GAUGE, not BATTERY pack + terminal.
- [1. POWER RAIL ARCHITECTURE]
  V_BAT    : Raw LiPo battery voltage.
  V_SYS    : System power managed by Charger (U4).
  Feeds the buck regulators.
  1V8      : Main MCU/Logic supply (Fixed 1.8V via U3).
  Always ON if V_SYS is present.
  V_REG_IO : Auxiliary Sensor supply (via U6).
  MCU controlled (see below).
- [4. CRITICAL HARDWARE NOTES]
  - BATTERY CONN : Design uses Low-Side sensing (R7).
  Battery connector MUST have separate
  PACK- and PACK+ terminals routed to U7.
  - NTC THERM    : Not used in this design. Charger configured
  to ignore TS pin (check R4/R1 resistors).
  -------------------------------------------------------
- (near U3) RSET = 0 sets the output to 1.8V
- [2. CONTROL & INTERRUPTS - MCU CONNECTIONS]
  PWR_KILL (P2.03) : System Shutdown / Ship Mode Control.
  Connects to Charger (U4).
  - Drive LOW to cut V_SYS output (Power Off).
  - Drive HIGH to keep system active.
  V_REG_EN (P2.05) : Sensor Regulator (U6) Enable.
  - HIGH = Output ON.
  - LOW  = Output OFF.
  CHG_IRQ  (P2.09) : Charger Interrupt (Active Low, Open Drain).
  Signals charging status changes, faults, etc.
  GAUGE_IRQ(P2.08) : Fuel Gauge Interrupt (Active Low, Open Drain).
  Signals low battery, state of charge changes.
- Designer/Engineer
- Drawn By
- Document Name
- Board Title
- Sheet
- of
- Size
- A4
- Approved By
- Rev.
- Date

### Library data of the parts
AC AC_GND BAT GND = TESTPAD: TESTPOINT PIN SMD; Category: Test and Measurement; Type: PC Test Point; Mounting Type: Surface Mount; Color: -
C6 C8 C14 = CL05A106MP5NUNC: Multilayer Ceramic Capacitor, 10 uF, 10 V, ± 20%, X5R, 0402 [1005 Metric]; Manufacturer: Samsung; Voltage Rating: 10V; Supplier: Arrow Electronics; Supplier Part Number: CL05A106MP5NUNC; Manufacturer Part Number: CL05A106MP5NUNC; RoHS: Yes; Category: Ceramic Capacitors; Stock: 275; Pricing: 1=0,1584, 10=0,0737, 25=0,073, 100=0,0424, 250=0,042, 500=0,0416, 1000=0,0375 (USD); Mounting Technology: Surface Mount; Case/Package: 0402; Case Code (Metric): 1005; Case Code (Imperial): 0402; Min Operating Temperature: -55°C; Max Operating Temperature: 85°C; Package Quantity: 1; Packaging: Tape and Reel; Value: 10uF; Tolerance: 20%; Dielectric: X5R; Series: CL; Length: 1mm; Width: 0.02inch; Thickness: 0.028inch; Depth: 0.5mm; Radiation Hardening: No; Lead Free: Lead Free; RoHS Compliant: Yes; ComponentLink1URL: https://datasheet.ciiva.com/25721/cl05a106mp5nunc-25721584.pdf?src-supplier=Digi-Key; ComponentLink1Description: https://datasheet.ciiva.com/25721/cl05a106mp5nunc-25721584.pdf?src-supplier=Digi-Key; ComponentLink2URL: https://datasheet.ciiva.com/26838/getdatasheetpartid-745310-26838170.pdf?src-supplier=Verical; ComponentLink2Description: https://datasheet.ciiva.com/26838/getdatasheetpartid-745310-26838170.pdf?src-supplier=Verical; Supplier 1: Mouser; Supplier Part Number 1: 187-CL05A106MP5NUNC; Supplier 2: Digikey; Supplier Part Number 2: 1276-1450-1-ND
C7 C10 = GRM155R61A475MEAAD: as C22 on sheet OpenRing_DaughterBoard; Manufacturer Part Number: GRM155R61A475MEAAD; RoHS: Yes; Category: Ceramic Capacitors; Stock: 930000; Pricing: 10000=0,0187, 50000=0,0159, 100000=0,0132 (USD); Mounting Technology: Surface Mount; Case/Package: 0402; Case Code (Imperial): 0402; Case Code (Metric): 1005; Min Operating Temperature: -55°C; Max Operating Temperature: 85°C; Packaging: Tape and Reel; Value: 4.7uF; Tolerance: 20%; Series: GRM; Voltage Rating (DC): 10V; Length: 1mm; Width: 500um; Height: 650um; Thickness: 500um; RoHS Compliant: Yes; ComponentLink1URL: http://www.farnell.com/datasheets/2189109.pdf?src-supplier=Farnell; ComponentLink1Description: http://www.farnell.com/datasheets/2189109.pdf?src-supplier=Farnell; ComponentLink2URL: http://www.farnell.com/datasheets/2189109.pdf?src-supplier=Newark; ComponentLink2Description: http://www.farnell.com/datasheets/2189109.pdf?src-supplier=Newark; ComponentLink3URL: http://www.farnell.com/datasheets/2189109.pdf?src-supplier=Element14; ComponentLink3Description: http://www.farnell.com/datasheets/2189109.pdf?src-supplier=Element14; ComponentLink4URL: http://datasheet.octopart.com/GRM155R61A475MEAAD-Murata-datasheet-68589269.pdf?src-supplier=Distrelec; ComponentLink4Description: http://datasheet.octopart.com/GRM155R61A475MEAAD-Murata-datasheet-68589269.pdf?src-supplier=Distrelec; ComponentLink5URL: http://datasheet.octopart.com/GRM155R61A475MEAAD-Murata-datasheet-68589269.pdf?src-supplier=Farnell; ComponentLink5Description: http://datasheet.octopart.com/GRM155R61A475MEAAD-Murata-datasheet-68589269.pdf?src-supplier=Farnell; ComponentLink6URL: https://search.murata.co.jp/Ceramy/image/img/A01X/G101/ENG/GRM155R61A475MEAA-01.pdf?src-supplier=Digi-Key; ComponentLink6Description: https://search.murata.co.jp/Ceramy/image/img/A01X/G101/ENG/GRM155R61A475MEAA-01.pdf?src-supplier=Digi-Key; ComponentLink7URL: http://datasheet.octopart.com/GRM155R61A475MEAAD-Murata-datasheet-68589269.pdf?src-supplier=Future+Electronics; ComponentLink7Description: http://datasheet.octopart.com/GRM155R61A475MEAAD-Murata-datasheet-68589269.pdf?src-supplier=Future+Electronics; ComponentLink8URL: https://datasheet.octopart.com/GRM155R61A475MEAAD-Murata-datasheet-68589269.pdf?src-supplier=Newark; ComponentLink8Description: https://datasheet.octopart.com/GRM155R61A475MEAAD-Murata-datasheet-68589269.pdf?src-supplier=Newark; ComponentLink9URL: http://datasheet.octopart.com/GRM155R61A475MEAAD-Murata-datasheet-68589269.pdf?src-supplier=Verical; ComponentLink9Description: http://datasheet.octopart.com/GRM155R61A475MEAAD-Murata-datasheet-68589269.pdf?src-supplier=Verical; ComponentLink10URL: https://datasheet.octopart.com/GRM155R61A475MEAAD-Murata-datasheet-165579666.pdf?src-supplier=TME; ComponentLink10Description: https://datasheet.octopart.com/GRM155R61A475MEAAD-Murata-datasheet-165579666.pdf?src-supplier=TME; ComponentLink11URL: http://datasheet.octopart.com/GRM155R61A475MEAAD-Murata-datasheet-68589269.pdf?src-supplier=Quest; ComponentLink11Description: http://datasheet.octopart.com/GRM155R61A475MEAAD-Murata-datasheet-68589269.pdf?src-supplier=Quest; ComponentLink12URL: http://datasheet.octopart.com/GRM155R61A475MEAAD-Murata-datasheet-68589269.pdf?src-supplier=TTI; ComponentLink12Description: http://datasheet.octopart.com/GRM155R61A475MEAAD-Murata-datasheet-68589269.pdf?src-supplier=TTI; ComponentLink13URL: http://datasheet.octopart.com/GRM155R61A475MEAAD-Murata-datasheet-68589269.pdf?src-supplier=NAC+Semi; ComponentLink13Description: http://datasheet.octopart.com/GRM155R61A475MEAAD-Murata-datasheet-68589269.pdf?src-supplier=NAC+Semi; Supplier 1: Mouser; Supplier Part Number 1: 81-GRM155R61A475MEAD; Supplier 2: Farnell; Supplier Part Number 2: 3581674
C9 = GRM155R61C104KA88D: as C5 on sheet OpenRing_Memory; Supplier 1: Mouser; Manufacturer Part Number: GRM155R61C104KA88D; RoHS: RoHS Compliant; Category: Multilayer Ceramic Capacitors MLCC - SMD/SMT; Packaging: Cut Tape; Capacitance: 0.1 uF; Package / Case: 0402 (1005 metric); ComponentLink1URL: http://www.mouser.com/datasheet/2/281/murata_03052018_GRM_Series_1-1310166.pdf; ComponentLink1Description: http://www.mouser.com/datasheet/2/281/murata_03052018_GRM_Series_1-1310166.pdf; Supplier Part Number 1: 81-GRM155R61C104KA8D; Value: 0.1 uF; Stock: 0; Pricing: 1=0.082, 10=0.026, 100=0.011, 500=0.008, 1000=0.007, 2500=0.006, 5000=0.005, 10000=0.004 (EUR); Height: 0.5 mm; Length: 1 mm; Product: General Type MLCCs; Series: GRM; Termination Style: SMD/SMT; Width: 0.5 mm; Brand: Murata Electronics; Case Code - in: 0402; Case Code - mm: 1005; Dielectric: X5R; Maximum Operating Temperature: + 85 C; Minimum Operating Temperature: - 55 C; Standard Pack Qty: 10000; Termination: Standard; RoHS - Mouser: Y; Minimum Order Quantity: 1; Reeling: True; Supplier 2: Digikey; Supplier Part Number 2: 490-5415-1-ND; Supplier 3: Digikey; Supplier Part Number 3: 490-5415-6-ND
C12 C17 = GRM155R61A105KE15D: CAP CER 1UF 10V X5R 0402; Manufacturer: Murata Electronics North America; Capacitance: 1µF; Tolerance: ±10%; Supplier 1: Digi-Key; Manufacturer Part Number: GRM155R61A105KE15D; RoHS: RoHS Compliant; Category: Capacitors; Stock 1: 5520111; Pricing 1: 1=0.1, 10=0.024, 50=0.013, 100=0.011, 250=0.009, 500=0.0077, 1000=0.006, 5000=0.005 (USD); Packaging: Digi-Reel®; Part Status: Active; Voltage - Rated: 10V; Temperature Coefficient: X5R; Mounting Type: Surface Mount, MLCC; Operating Temperature: -55°C ~ 85°C; Applications: General Purpose; Ratings: -; Package / Case: 0402 (1005 Metric); Size / Dimension: 0.039" L x 0.020" W (1.00mm x 0.50mm); Height - Seated (Max): -; Thickness (Max): 0.022" (0.55mm); Lead Spacing: -; Features: -; Lead Style: -; ComponentLink1URL: http://www.murata.com/~/media/webrenewal/support/library/catalog/products/capacitor/mlcc/c02e.ashx; ComponentLink1Description: http://www.murata.com/~/media/webrenewal/support/library/catalog/products/capacitor/mlcc/c02e.ashx; Supplier Part Number 1: 490-3890-6-ND; Value: 1 uF
C15 = CL10A476MQ8QRNC: CL10 Series 0603 47 uF 6.3 V ±20% Tolerance X5R Multilayer Ceramic Capacitor; Manufacturer: Samsung; Supplier: Digikey; Supplier Part Number: 1276-CL10A476MQ8QRNCCT-ND; Manufacturer Part Number: CL10A476MQ8QRNC; RoHS: Yes; Category: Ceramic Capacitors; Stock: 103327; Pricing: 1=1.04, 10=0.669, 100=0.477, 1000=0.37689 (USD); Case/Package: 345Case; Min Operating Temperature: -55°C; Max Operating Temperature: 85°C; Value: 47uF; Tolerance: 20%; Lead Free: 5697LeadFree; RoHS Compliant: 5897YesNo; ComponentLink1URL: https://datasheet.octopart.com/CL10A476MQ8QRNC-Samsung-Electro-Mechanics-datasheet-68300278.pdf?src-supplier=Future+Electronics; ComponentLink1Description: https://datasheet.octopart.com/CL10A476MQ8QRNC-Samsung-Electro-Mechanics-datasheet-68300278.pdf?src-supplier=Future+Electronics; Supplier 1: Digikey; Supplier Part Number 1: 1276-CL10A476MQ8QRNCCT-ND; Supplier 2: Digikey; Supplier Part Number 2: 1276-CL10A476MQ8QRNCDKR-ND
C16 = GRM155R61A225KE95D: CAP CER 2.2UF 10V X5R 0402; Manufacturer: Murata Electronics North America; Capacitance: 2.2µF; Tolerance: ±10%; Supplier 1: Digi-Key; Manufacturer Part Number: GRM155R61A225KE95D; RoHS: RoHS Compliant; Category: Capacitors; Stock 1: 370562; Pricing 1: 1=0.1, 10=0.06, 50=0.0326, 100=0.0275, 250=0.02252, 500=0.01926, 1000=0.015, 5000=0.0125 (USD); Packaging: Digi-Reel®; Part Status: Active; Voltage - Rated: 10V; Temperature Coefficient: X5R; Operating Temperature: -55°C ~ 85°C; Features: Derating Recommended; Ratings: -; Applications: General Purpose; Mounting Type: Surface Mount, MLCC; Package / Case: 0402 (1005 Metric); Size / Dimension: 0.039" L x 0.020" W (1.00mm x 0.50mm); Height - Seated (Max): -; Thickness (Max): 0.022" (0.55mm); Lead Spacing: -; Lead Style: -; ComponentLink1URL: http://www.murata.com/~/media/webrenewal/support/library/catalog/products/capacitor/mlcc/c02e.ashx; ComponentLink1Description: http://www.murata.com/~/media/webrenewal/support/library/catalog/products/capacitor/mlcc/c02e.ashx; Supplier Part Number 1: 490-10451-6-ND; Value: 2.2 uF
L1 = DFE201612E-2R2M=P2: Inductor Power Shielded Wirewound 2.2uH 20% 1MHz Metal 1.8A 0.116Ohm DCR 0806 T/R; Manufacturer: Murata; Saturation Current: 2.4A; ESR: 116mR; Supplier: Mouser; Supplier Part Number: 81-DFE201612E-2R2MP2; Manufacturer Part Number: DFE201612E-2R2M=P2; RoHS: Yes; Category: Fixed Inductors; Stock: 102000; Pricing: 3000=0,0929 (USD); ComponentLink1URL: http://www.farnell.com/datasheets/2339714.pdf?src-supplier=Farnell; ComponentLink1Description: http://www.farnell.com/datasheets/2339714.pdf?src-supplier=Farnell; ComponentLink2URL: https://search.murata.co.jp/Ceramy/image/img/P02/J(E)TE243A-0006.pdf?src-supplier=Digi-Key; ComponentLink2Description: https://search.murata.co.jp/Ceramy/image/img/P02/J(E)TE243A-0006.pdf?src-supplier=Digi-Key; ComponentLink3URL: http://www.farnell.com/datasheets/2339714.pdf?src-supplier=Newark; ComponentLink3Description: http://www.farnell.com/datasheets/2339714.pdf?src-supplier=Newark; ComponentLink4URL: https://datasheet.octopart.com/DFE201612E-2R2M%3DP2-Murata-datasheet-150582460.pdf?src-supplier=Arrow.cn; ComponentLink4Description: https://datasheet.octopart.com/DFE201612E-2R2M%3DP2-Murata-datasheet-150582460.pdf?src-supplier=Arrow.cn; Supplier 1: Mouser; Supplier Part Number 1: 81-DFE201612E-2R2MP2; Value: 2.2 uH; Min Operating Temperature: -40°C; Max Operating Temperature: 125°C; Current Rating: 1.8A; Inductance Tolerance: 20%; Packaging: 13Packaging; RMS Current (Irms): 1.8A; Test Frequency: 1MHz; Height: 1.2mm; ComponentLink5URL: https://search.murata.co.jp/Ceramy/image/img/P02/J(E)TE243A-0006.pdf?src-supplier=Digikey; ComponentLink5Description: https://search.murata.co.jp/Ceramy/image/img/P02/J(E)TE243A-0006.pdf?src-supplier=Digikey; Supplier 2: Digikey; Supplier Part Number 2: 490-DFE201612E-2R2M=P2CT-ND; Supplier 3: Digikey; Supplier Part Number 3: 490-DFE201612E-2R2M=P2DKR-ND
P1 = RM-1238-B02-41: RM-1238-B02-41 by www.xtpogopin.com; Manufacturer: XTPogoPin; Manufacturer Part Number: RM-1238-B02-41
R3 R6-R8 = ERJ-2RKF1004X: as R1 on sheet OpenRing_Memory; Supplier 1: Digi-Key; Manufacturer Part Number: ERJ-2RKF1004X; RoHS: RoHS Compliant; Category: Resistors; Stock 1: 1590446; Pricing 1: 1=0.1, 10=0.025, 25=0.018, 50=0.0136, 100=0.01, 250=0.00764, 500=0.00612, 1000=0.00451, 5000=0.00323 (USD); Packaging: Digi-Reel®; Part Status: Active; Resistance (Ohms): 1M; Tolerance: ±1%; Composition: Thick Film; Features: Automotive AEC-Q200; Operating Temperature: -55°C ~ 155°C; Package / Case: 0402 (1005 Metric); Supplier Device Package: 0402; Size / Dimension: 0.039" L x 0.020" W (1.00mm x 0.50mm); Number of Terminations: 2; Failure Rate: -; ComponentLink1URL: https://industrial.panasonic.com/cdbs/www-data/pdf/RDA0000/AOA0000C283.pdf; ComponentLink1Description: https://industrial.panasonic.com/cdbs/www-data/pdf/RDA0000/AOA0000C283.pdf; Supplier Part Number 1: P1.00MLDKR-ND; Value: 1 M; Height - Seated (Max): 0.016" (0.40mm)
R4 = ERJ-2RKF1003X: RES SMD 100K OHM 1% 1/10W 0402; Manufacturer: Panasonic Electronic Components; Power (Watts): 0.1W, 1/10W; Temperature Coefficient: ±100ppm/°C; Supplier 1: Digi-Key; Manufacturer Part Number: ERJ-2RKF1003X; RoHS: RoHS Compliant; Category: Resistors; Stock 1: 5976308; Pricing 1: 1=0.1, 10=0.025, 25=0.018, 50=0.0136, 100=0.01, 250=0.00764, 500=0.00612, 1000=0.00451, 5000=0.00323 (USD); Packaging: Digi-Reel®; Part Status: Active; Resistance (Ohms): 100k; Tolerance: ±1%; Composition: Thick Film; Features: Automotive AEC-Q200; Operating Temperature: -55°C ~ 155°C; Package / Case: 0402 (1005 Metric); Supplier Device Package: 0402; Size / Dimension: 0.039" L x 0.020" W (1.00mm x 0.50mm); Height - Seated (Max): 0.016" (0.40mm); Number of Terminations: 2; Failure Rate: -; ComponentLink1URL: https://industrial.panasonic.com/cdbs/www-data/pdf/RDA0000/AOA0000C283.pdf; ComponentLink1Description: https://industrial.panasonic.com/cdbs/www-data/pdf/RDA0000/AOA0000C283.pdf; Supplier Part Number 1: P100KLDKR-ND; Value: 100 k
R19 = ERJ-2RKF1002X: RES SMD 10K OHM 1% 1/10W 0402; Manufacturer: Panasonic Electronic Components; Power (Watts): 0.1W, 1/10W; Temperature Coefficient: ±100ppm/°C; Supplier 1: Digi-Key; Manufacturer Part Number: ERJ-2RKF1002X; RoHS: RoHS Compliant; Category: Resistors; Stock 1: 8105773; Pricing 1: 1=0.1, 10=0.025, 25=0.018, 50=0.0136, 100=0.01, 250=0.00764, 500=0.00612, 1000=0.00451, 5000=0.00323 (USD); Packaging: Digi-Reel®; Part Status: Active; Resistance (Ohms): 10k; Tolerance: ±1%; Composition: Thick Film; Features: Automotive AEC-Q200; Operating Temperature: -55°C ~ 155°C; Package / Case: 0402 (1005 Metric); Supplier Device Package: 0402; Size / Dimension: 0.039" L x 0.020" W (1.00mm x 0.50mm); Height - Seated (Max): 0.016" (0.40mm); Number of Terminations: 2; Failure Rate: -; ComponentLink1URL: https://industrial.panasonic.com/cdbs/www-data/pdf/RDA0000/AOA0000C283.pdf; ComponentLink1Description: https://industrial.panasonic.com/cdbs/www-data/pdf/RDA0000/AOA0000C283.pdf; Supplier Part Number 1: P10.0KLDKR-ND; Value: 10 k
U3 = TPS62840YBGR: Conv DC-DC 1.8V to 6.5V Synchronous Step Down Single-Out 1.8V to 3.3V 0.75A 6-Pin DSBGA T/R; Manufacturer: Texas Instruments; Supplier: Mouser; Supplier Part Number: 595-TPS62840YBGR; Manufacturer Part Number: TPS62840YBGR; RoHS: Yes; Category: Voltage Regulators - Switching; Stock: 2271; Pricing: 1=1,97, 10=1,77, 50=1,77, 100=1,42, 1000=0,972, 10000=0,865 (USD); Supplier 1: Mouser; Supplier Part Number 1: 595-TPS62840YBGR
U4 = BQ25180YBGR: 1-A Li-ion I²C programmable charger with regulated power path in WCSP package 8-DSBGA -40 to 85; Manufacturer: Texas Instruments; Supplier: Digi-Key; Supplier Part Number: 296-BQ25180YBGRCT-ND; Manufacturer Part Number: BQ25180YBGR; RoHS: No; Category: Integrated Circuits (ICs); Stock: 2812; Pricing: 1=2,65, 10=2,382, 25=2,2472, 100=1,9147, 250=1,7978, 500=1,57308, 1000=1,3034 (USD); Supplier 1: Mouser; Supplier Part Number 1: 595-BQ25180YBGR
U6 = TPSM831021SIUR: 1.5A output current, buck-boost MicroSiP™ power module with integrated inductor with I²C 8-uSiP -40 to 125; Manufacturer: Texas Instruments; Manufacturer Lifecycle Status: ACTIVE; Supplier: Mouser; Supplier Part Number: 595-TPSM831021SIUR; Manufacturer Part Number: TPSM831021SIUR; RoHS: Compliant; Stock: 2610; Pricing: 1=7.7, 10=6.91, 50=6.91, 100=5.66, 1000=4.06, 10000=3.86 (USD); Pins: 8; Topology: Buck-Boost; Length: 2.6mm; Width: 2mm; Thickness: 1.15mm; Supplier 1: Mouser; Supplier Part Number 1: 595-TPSM831021SIUR; Category: Voltage Regulators - Switching; Lifecycle Status: Production; ComponentLink1URL: https://octopart.com:443/opatz8j6/c1?t=1vxQQwx7TOAj9FA5SAjYf-PM2GMohsbgC04BrqIyIUoGmA7zdRLwbkPi0-I8FrksUgPxUwbGCYWtwThYV-KnzQfz1oTrUxzeL5cOfaQnthmRq6ADpCLaHp5JrIbb6cgfJIMgeLAStVpvqMRJWc6Yal_MwBsyemKGdD71ihduhM8mRGYBabo_yu3Qx5wXw-xz84pVCfLzcr0zIMJbnrhY9ixfkLjguXZyMK1DFLb7NzaBV3N62BonJqonzahOnLJWkG214iKtXDOwsTkVLMpxpvY7ilA5fe2cf7_u5R_sEAjjMbnvkWUs-qzHlIvYXhlQIX-e4wdexaSxNG4YUph8zgYx4izLfMmtyaps11Lo0lWlOmAtv_UcgO7e3icqZp1421nsrlt2N-g&src-supplier=Texas+Instruments; ComponentLink1Description: https://octopart.com:443/opatz8j6/c1?t=1vxQQwx7TOAj9FA5SAjYf-PM2GMohsbgC04BrqIyIUoGmA7zdRLwbkPi0-I8FrksUgPxUwbGCYWtwThYV-KnzQfz1oTrUxzeL5cOfaQnthmRq6ADpCLaHp5JrIbb6cgfJIMgeLAStVpvqMRJWc6Yal_MwBsyemKGdD71ihduhM8mRGYBabo_yu3Qx5wXw-xz84pVCfLzcr0zIMJbnrhY9ixfkLjguXZyMK1DFLb7NzaBV3N62BonJqonzahOnLJWkG214iKtXDOwsTkVLMpxpvY7ilA5fe2cf7_u5R_sEAjjMbnvkWUs-qzHlIvYXhlQIX-e4wdexaSxNG4YUph8zgYx4izLfMmtyaps11Lo0lWlOmAtv_UcgO7e3icqZp1421nsrlt2N-g&src-supplier=Texas+Instruments; ComponentLink2URL: http://sigma.octopart.com:80/reach_statement/Texas-Instruments-company-64.pdf?src-supplier=Compliance+Statements; ComponentLink2Description: http://sigma.octopart.com:80/reach_statement/Texas-Instruments-company-64.pdf?src-supplier=Compliance+Statements; ComponentLink3URL: http://sigma.octopart.com:80/conflict_mineral_statement/Texas-Instruments-company-63.pdf?src-supplier=Compliance+Statements; ComponentLink3Description: http://sigma.octopart.com:80/conflict_mineral_statement/Texas-Instruments-company-63.pdf?src-supplier=Compliance+Statements
U7 = BQ27427YZFR: Single-cell battery fuel gauge with pre-programmed chemistry and integrated sense resistor 9-DSBGA -40 to 85; Manufacturer: Texas Instruments; Supplier: Mouser; Supplier Part Number: 595-BQ27427YZFR; Manufacturer Part Number: BQ27427YZFR; RoHS: No; Stock: 1221; Pricing: 1=2,56, 10=2,31, 50=2,18, 100=1,86, 1000=1,26, 10000=1,15 (USD); Supplier 1: Mouser; Supplier Part Number 1: 595-BQ27427YZFR

## Sheet OpenRing_TitlePage.SchDoc
size A4; Size: A4; ApprovedBy: Dariush Salami; DrawnBy: Yusein Ali; Engineer: Yusein Ali; Revision: A0; SheetNumber: 8; SheetTotal: 9

### Notes on the sheet
- Designer/Engineer
- Drawn By
- Document Name
- Board Title
- Sheet
- of
- Size
- A4
- Approved By
- Rev.
- Date

## Nets that join several sheets
1V8: OpenRing_MCU (12 pins), OpenRing_Debug (P2.1), OpenRing_MPU (5 pins), OpenRing_Memory (C5.2 R1.2 U2.A2), OpenRing_DaughterBoard (C22.2 P3.8), OpenRing_Power (5 pins)
GND: OpenRing_MCU (20 pins), OpenRing_Debug (P2.7 P2.11), OpenRing_MPU (5 pins), OpenRing_Memory (C5.1 U2.D1), OpenRing_RGB (5 pins), OpenRing_DaughterBoard (C22.1 C23.1 C24.2 P3.10), OpenRing_Power (23 pins)
V_REG_IO: OpenRing_DaughterBoard (C23.2 P3.9), OpenRing_Power (C15.2 U6.4)
V_SYS: OpenRing_RGB (C11.1 LED1.1 U5.A2), OpenRing_DaughterBoard (C24.1 P3.1), OpenRing_Power (7 pins)
CHG_IRQ: OpenRing_MCU (U1.20), OpenRing_Power (R3.2 U4.A1)
GAUGE_IRQ: OpenRing_MCU (U1.19), OpenRing_Power (R8.2 U7.A1)
LED_EN: OpenRing_MCU (U1.17), OpenRing_RGB (U5.C3)
MCU_~{RESET}: OpenRing_MCU (C25.2 U1.30), OpenRing_Debug (P2.6)
MCU_RX: OpenRing_MCU (U1.28), OpenRing_Debug (P2.2)
MCU_SWD_CLK: OpenRing_MCU (U1.26), OpenRing_Debug (P2.5)
MCU_SWD_IO: OpenRing_MCU (U1.25), OpenRing_Debug (P2.3)
MCU_TX: OpenRing_MCU (U1.29), OpenRing_Debug (P2.4)
MEM_SPI_~{CS}: OpenRing_MCU (U1.18), OpenRing_Memory (U2.A1)
MPU_CLK: OpenRing_MCU (U1.12), OpenRing_MPU (U8.13), OpenRing_Memory (U2.C2)
MPU_CS#: OpenRing_MCU (U1.41), OpenRing_MPU (U8.12)
MPU_GPIO0: OpenRing_MCU (U1.8), OpenRing_MPU (U8.2)
MPU_GPIO1: OpenRing_MCU (U1.9), OpenRing_MPU (U8.3)
MPU_GPIO2: OpenRing_MCU (U1.42), OpenRing_MPU (U8.10)
MPU_IRQ#: OpenRing_MCU (U1.11), OpenRing_MPU (U8.4)
MPU_MISO: OpenRing_MCU (U1.15), OpenRing_MPU (U8.1), OpenRing_Memory (U2.B1)
MPU_MOSI: OpenRing_MCU (U1.13), OpenRing_MPU (U8.14), OpenRing_Memory (U2.D2)
MPU_~{RESET}: OpenRing_MCU (U1.7), OpenRing_Debug (R2.1), OpenRing_MPU (R9.2 U8.17)
MPU_SWD_CLK: OpenRing_Debug (P2.10), OpenRing_MPU (U8.15)
MPU_SWD_DIO: OpenRing_Debug (P2.9), OpenRing_MPU (U8.16)
PWR_I2C_SCL: OpenRing_MCU (R15.2 U1.4), OpenRing_RGB (U5.C2), OpenRing_DaughterBoard (P3.2), OpenRing_Power (U4.B1 U6.5 U7.A3)
PWR_I2C_SDA: OpenRing_MCU (R16.2 U1.3), OpenRing_RGB (U5.C1), OpenRing_DaughterBoard (P3.3), OpenRing_Power (U4.C1 U6.7 U7.A2)
PWR_~{KILL}: OpenRing_MCU (U1.14), OpenRing_Power (R4.1 U4.D1)
SENSOR_GPIO_0: OpenRing_MCU (U1.40), OpenRing_DaughterBoard (P3.4)
SENSOR_GPIO_1: OpenRing_MCU (U1.5), OpenRing_DaughterBoard (P3.5)
SENSOR_GPIO_2: OpenRing_MCU (U1.6), OpenRing_DaughterBoard (P3.6)
SENSOR_GPIO_3: OpenRing_MCU (U1.21), OpenRing_DaughterBoard (P3.7)
V_REG_EN: OpenRing_MCU (U1.16), OpenRing_Power (R6.2 U6.8)